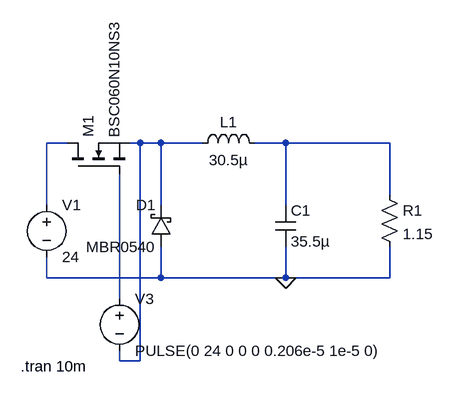
[diagram p0: schematic BuckConverterLT.asc]
BuckConverterLT.asc, the LTspice schematic file:
Version 4
SHEET 1 880 680
WIRE 160 16 128 16
WIRE 272 16 256 16
WIRE 304 16 272 16
WIRE 368 16 304 16
WIRE 496 16 448 16
WIRE 656 16 496 16
WIRE 656 96 656 16
WIRE 128 112 128 16
WIRE 304 112 304 16
WIRE 496 112 496 16
WIRE 128 224 128 192
WIRE 304 224 304 176
WIRE 304 224 128 224
WIRE 496 224 496 176
WIRE 496 224 304 224
WIRE 656 224 656 176
WIRE 656 224 496 224
WIRE 240 256 240 64
WIRE 240 352 240 336
WIRE 272 352 272 16
WIRE 272 352 240 352
FLAG 496 224 0
SYMBOL voltage 128 96 R0
SYMATTR InstName V1
SYMATTR Value 24
SYMBOL ind 352 32 R270
WINDOW 0 32 56 VTop 2
WINDOW 3 5 56 VBottom 2
SYMATTR InstName L1
SYMATTR Value 30.5µ
SYMATTR SpiceLine Ipk=1 Rser=0.019 Rpar=0 Cpar=0 mfg="Hurricane" pn="HL-8189"
SYMBOL schottky 320 176 R180
WINDOW 0 24 64 Left 2
WINDOW 3 24 0 Left 2
SYMATTR InstName D1
SYMATTR Value MBR0540
SYMATTR Description Diode
SYMATTR Type diode
SYMBOL cap 480 112 R0
SYMATTR InstName C1
SYMATTR Value 35.5µ
SYMATTR SpiceLine Rser=0 Lser=0
SYMBOL res 640 80 R0
SYMATTR InstName R1
SYMATTR Value 1.15
SYMBOL nmos 160 64 R270
SYMATTR InstName M1
SYMATTR Value BSC060N10NS3
SYMBOL voltage 240 240 R0
WINDOW 123 0 0 Left 0
WINDOW 39 0 0 Left 0
SYMATTR InstName V3
SYMATTR Value PULSE(0 24 0 0 0 0.206e-5 1e-5 0)
TEXT 88 360 Left 2 !.tran 10m

The netlist it stands for:
* BuckConverterLT.asc
V1 N001 0 24
L1 N002 N003 30.5µ Ipk=1 Rser=0.019 Rpar=0 Cpar=0 mfg="Hurricane" pn="HL-8189"
D1 0 N002 MBR0540
C1 N003 0 35.5µ Rser=0 Lser=0
R1 N003 0 1.15
M1 N001 N004 N002 N002 BSC060N10NS3
V3 N004 N002 PULSE(0 24 0 0 0 0.206e-5 1e-5 0)
.model D D
.lib standard.dio
.model NMOS NMOS
.model PMOS PMOS
.lib standard.mos
.tran 10m
.backanno
.end